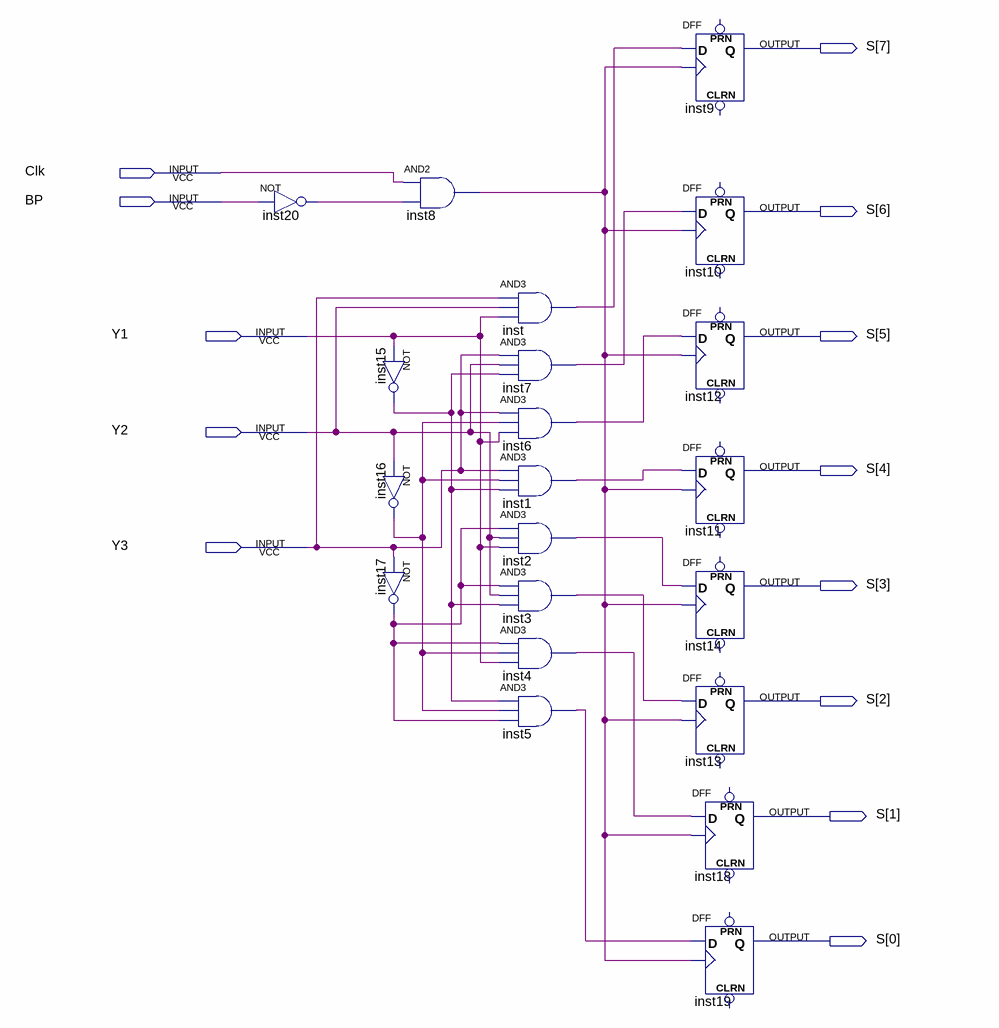
[diagram p0: schematic sheet]
// Quartus schematic Mux3-8V2.bdf as structural Verilog: 21 symbols, 13 pins
module \Mux3-8V2  (
  input  Clk,
  input  BP,
  input  Y1,
  input  Y2,
  input  Y3,
  output [7:0] S
);

  wire inst1_out, inst2_out, inst3_out, inst4_out, inst5_out, inst6_out, inst7_out, inst8_out, inst15_out,
       inst16_out, inst17_out, inst20_out, inst_out;

  not inst20 (inst20_out, BP);
  and inst8 (inst8_out, Clk, inst20_out);
  not inst15 (inst15_out, Y1);
  not inst16 (inst16_out, Y2);
  not inst17 (inst17_out, Y3);
  and inst (inst_out, Y3, Y2, Y1);
  and inst7 (inst7_out, Y3, Y2, inst15_out);
  and inst6 (inst6_out, Y3, inst16_out, Y1);
  and inst1 (inst1_out, Y3, inst16_out, inst15_out);
  and inst2 (inst2_out, inst17_out, Y2, Y1);
  and inst3 (inst3_out, inst17_out, Y2, inst15_out);
  and inst4 (inst4_out, inst17_out, inst16_out, Y1);
  and inst5 (inst5_out, inst15_out, inst16_out, inst17_out);
  DFF inst9 (.CLK(inst8_out), .D(inst_out), .Q(S[7]));  // open: CLRN, PRN
  DFF inst10 (.CLK(inst8_out), .D(inst7_out), .Q(S[6]));  // open: CLRN, PRN
  DFF inst12 (.CLK(inst8_out), .D(inst6_out), .Q(S[5]));  // open: CLRN, PRN
  DFF inst11 (.CLK(inst8_out), .D(inst1_out), .Q(S[4]));  // open: CLRN, PRN
  DFF inst14 (.CLK(inst8_out), .D(inst2_out), .Q(S[3]));  // open: CLRN, PRN
  DFF inst13 (.CLK(inst8_out), .D(inst3_out), .Q(S[2]));  // open: CLRN, PRN
  DFF inst18 (.CLK(inst8_out), .D(inst4_out), .Q(S[1]));  // open: CLRN, PRN
  DFF inst19 (.CLK(inst8_out), .D(inst5_out), .Q(S[0]));  // open: CLRN, PRN
endmodule
